# EasyEDA schematic SCH_PCB1_2026-10-08.json

## Sheets
1 Sheet_2: TITLE: Sheet_2; REV: 1.0; Date: 2026-10-06; Sheet: 1/1; Drawn By: khilranikohana28; Company: Your Company
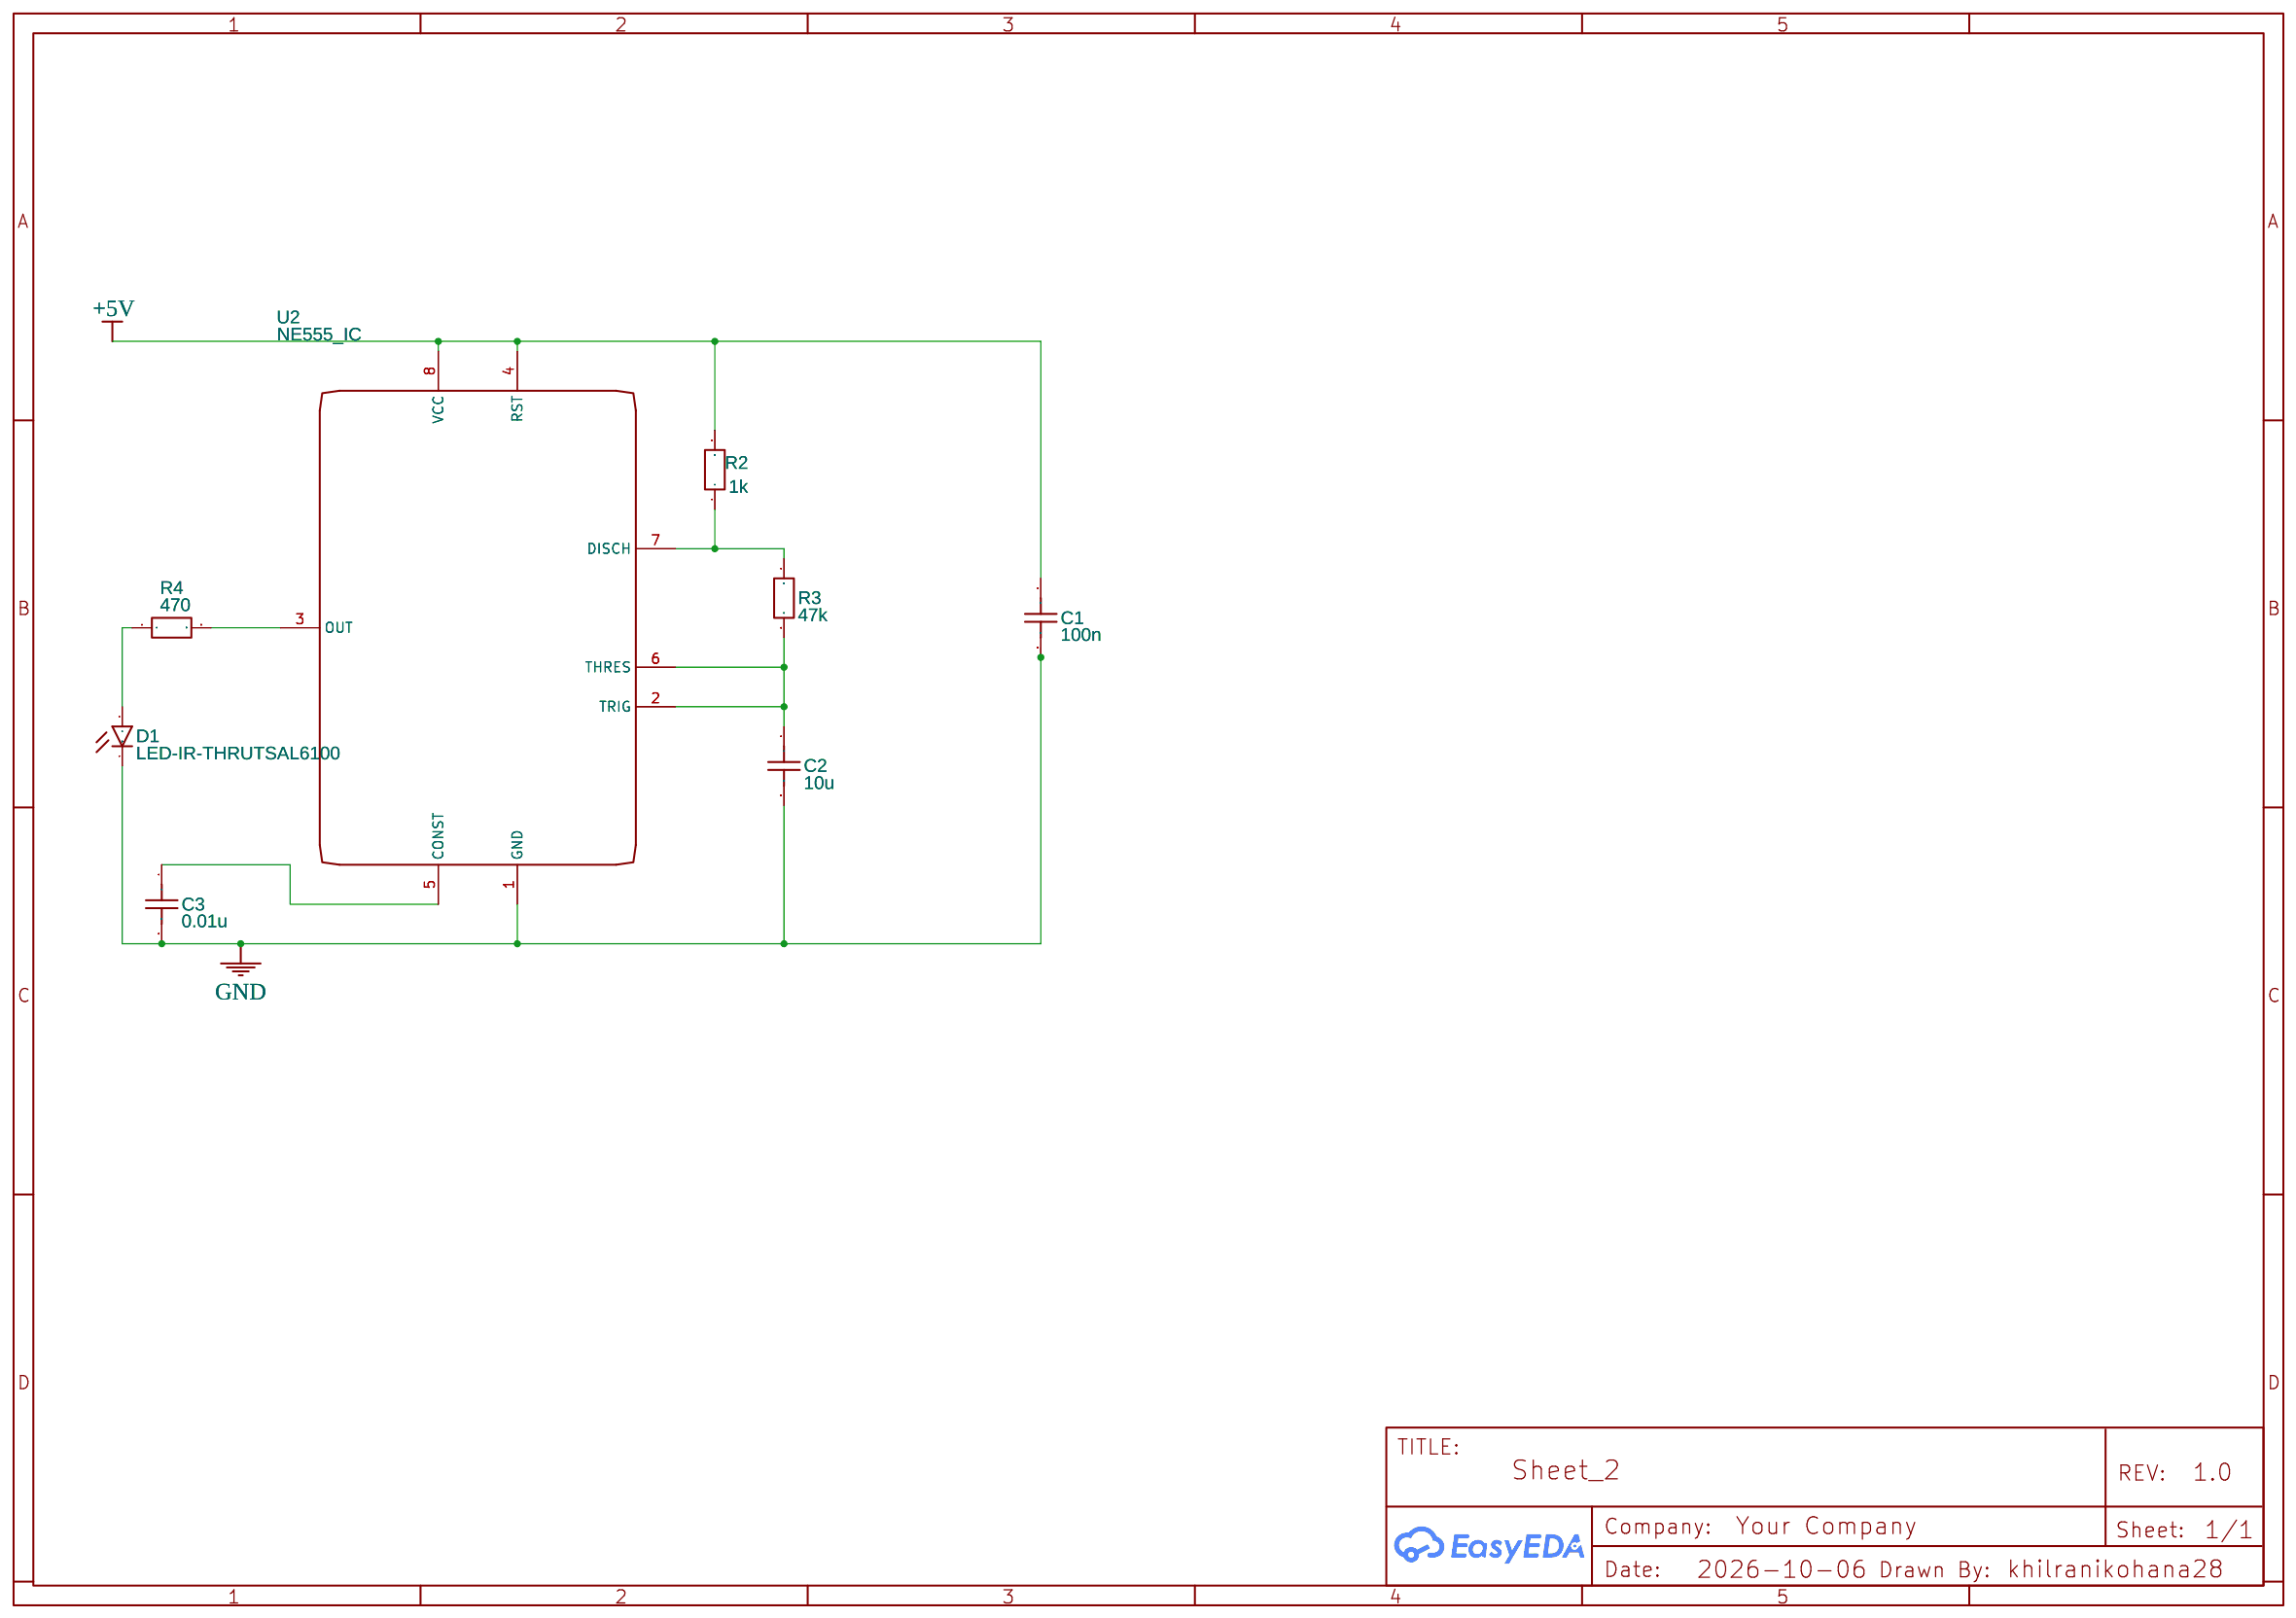
[diagram p0: Sheet_2]
2 Sheet_3: TITLE: Sheet_3; Date: 2026-10-08
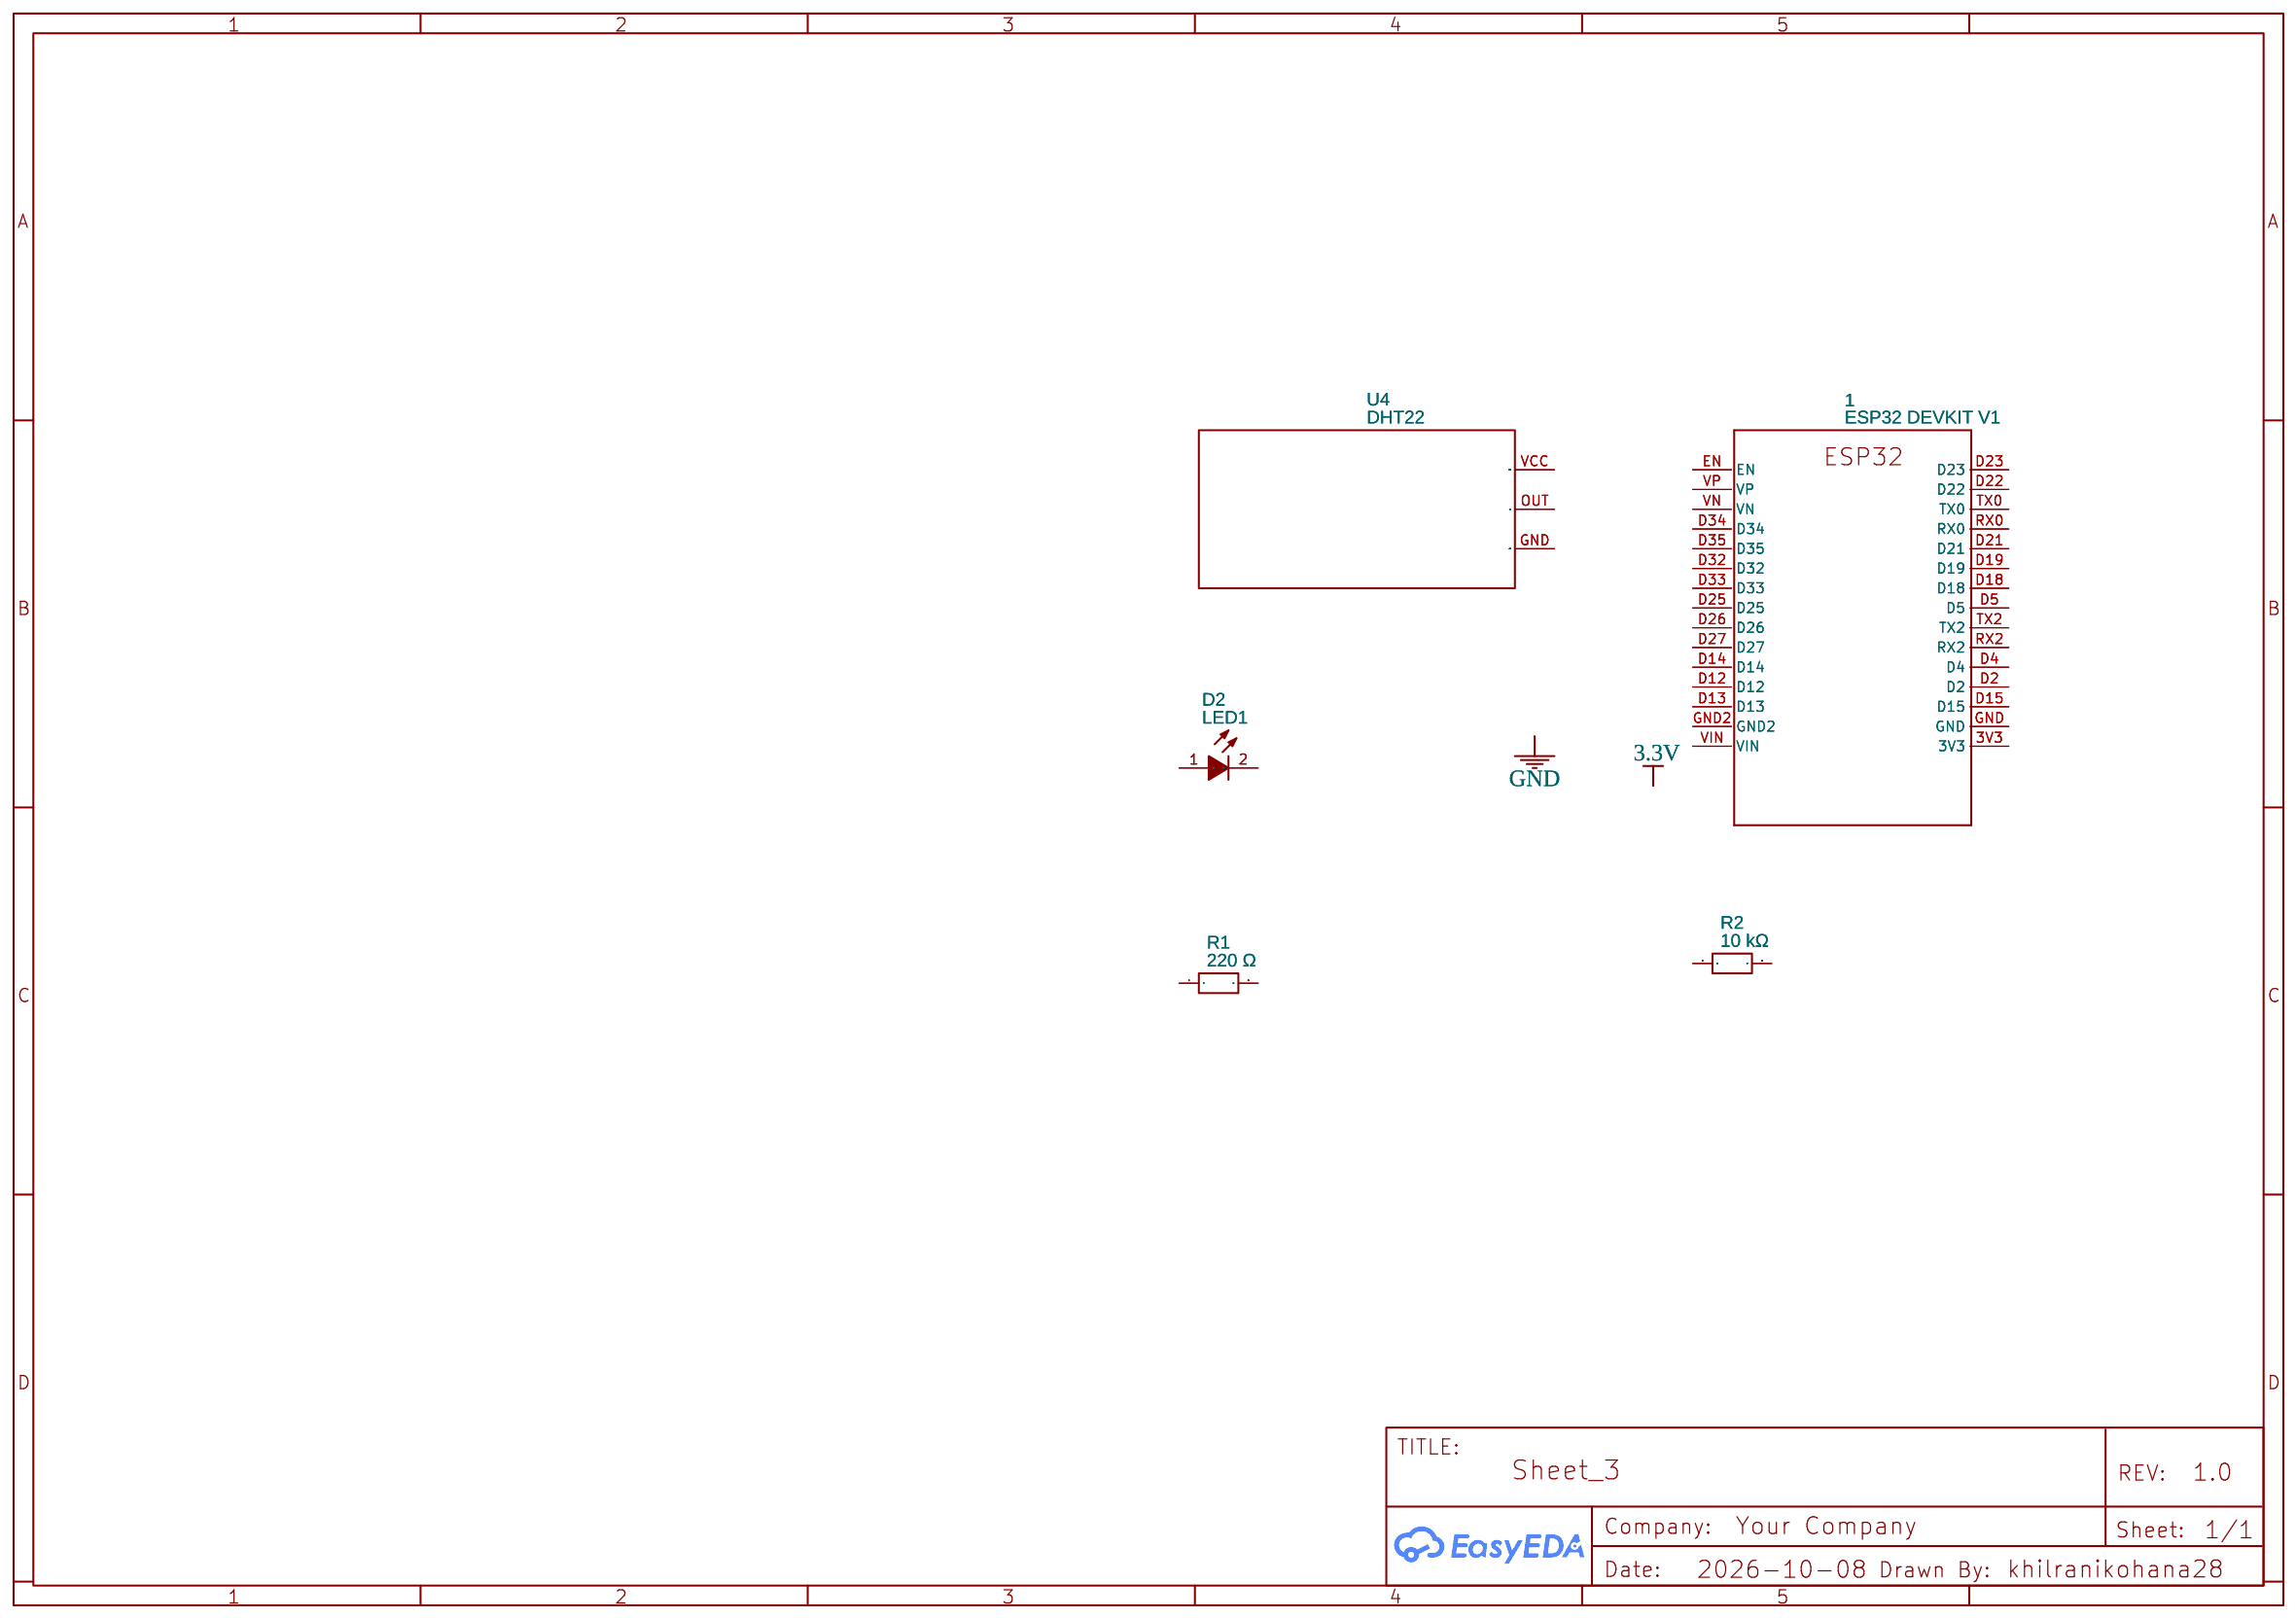
[diagram p1: Sheet_3]

## Parts
sheet Sheet_2
C1  100n  [C0603]
C2  10u  [C0603]
C3  0.01u  [C0603]
D1  LED-IR-THRUTSAL6100  [LED5MM]
R2  1k  [R0603]
R3  47k  [R0603]
R4  470  [R0603]
U2  NE555_IC  [DIP-08]
sheet Sheet_3
1  ESP32 DEVKIT V1  [ESP32-DEVKITV1_ESP32-DEVKITV1]
D2  LED1  [LED-TH_LED-DP2-2LED-AMCC]
R1  220 Ω  [R0603]
R2#2  10 kΩ  [R0603]
U4  DHT22  [FOOTPRINT--XX--DHT22-HUMID-TEMP-SENSOR]

## Library data of the parts
C1-C3 = C_0603_US: Contributor: LCEDA_Lib
D1 = LED-IR-THRUTSAL6100: Contributor: SparkFun
R1 R2 R2#2 R3 R4 = R_0603_EU: Contributor: LCEDA_Lib
U2 = NE555_IC: Manufacturer: Diodes Incorporation; Manufacturer Part: NE555; Supplier Part: NE555; Contributor: vijjupattar07
1 = ESP32-DEVKIT-V1-30PIN: Contributor: Veeravalli ravi chandra
D2 = LED: Supplier: Digi-Key; Manufacturer: VccLite; Manufacturer Part: 5600; Supplier Part: L20325-ND; link: https://vcclite.com/product/5602f5-5v/; Contributor: budisatria
U4 = DHT22: Contributor: twentysix.lolol

## Nets
+5V: C1.1 R2.2 U2.4(RST) U2.8(VCC)
GND: C1.2 C2.2 C3.2 D1.K(C) U2.1(GND)
Net-(C2-1): C2.1 R3.2 U2.2(TRIG) U2.6(THRES)
Net-(C3-1): C3.1 U2.5(CONST)
Net-(D1-A): D1.A R4.1
Net-(R2-1): R2.1 R3.1 U2.7(DISCH)
Net-(R4-2): R4.2 U2.3(OUT)

Not connected (* = marked no-connect by the designer): 1 3V3 D2 D4 D5 D12 D13 D14 D15 D18 D19 D21 D22 D23 D25 D26 D27 D32 D33 D34 D35 EN GND GND2 RX0 RX2 TX0 TX2 VIN VN VP; D2 1(A) 2(K); R1 1 2; R2#2 1 2; U4 GND(gnd) OUT(5v) VCC(data)
